# EAGLE design CouchProtato-TOP (EAGLE 9.5.2)
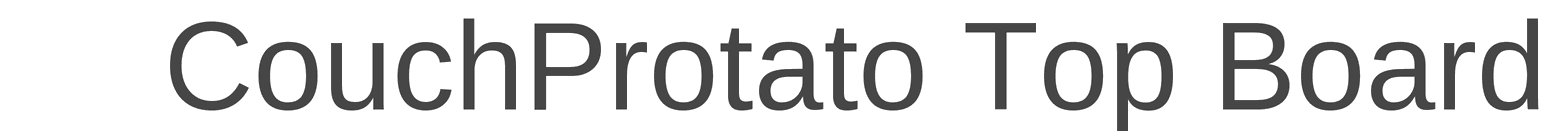
[diagram p0: schematic, sheet 1, part 1 of 2]
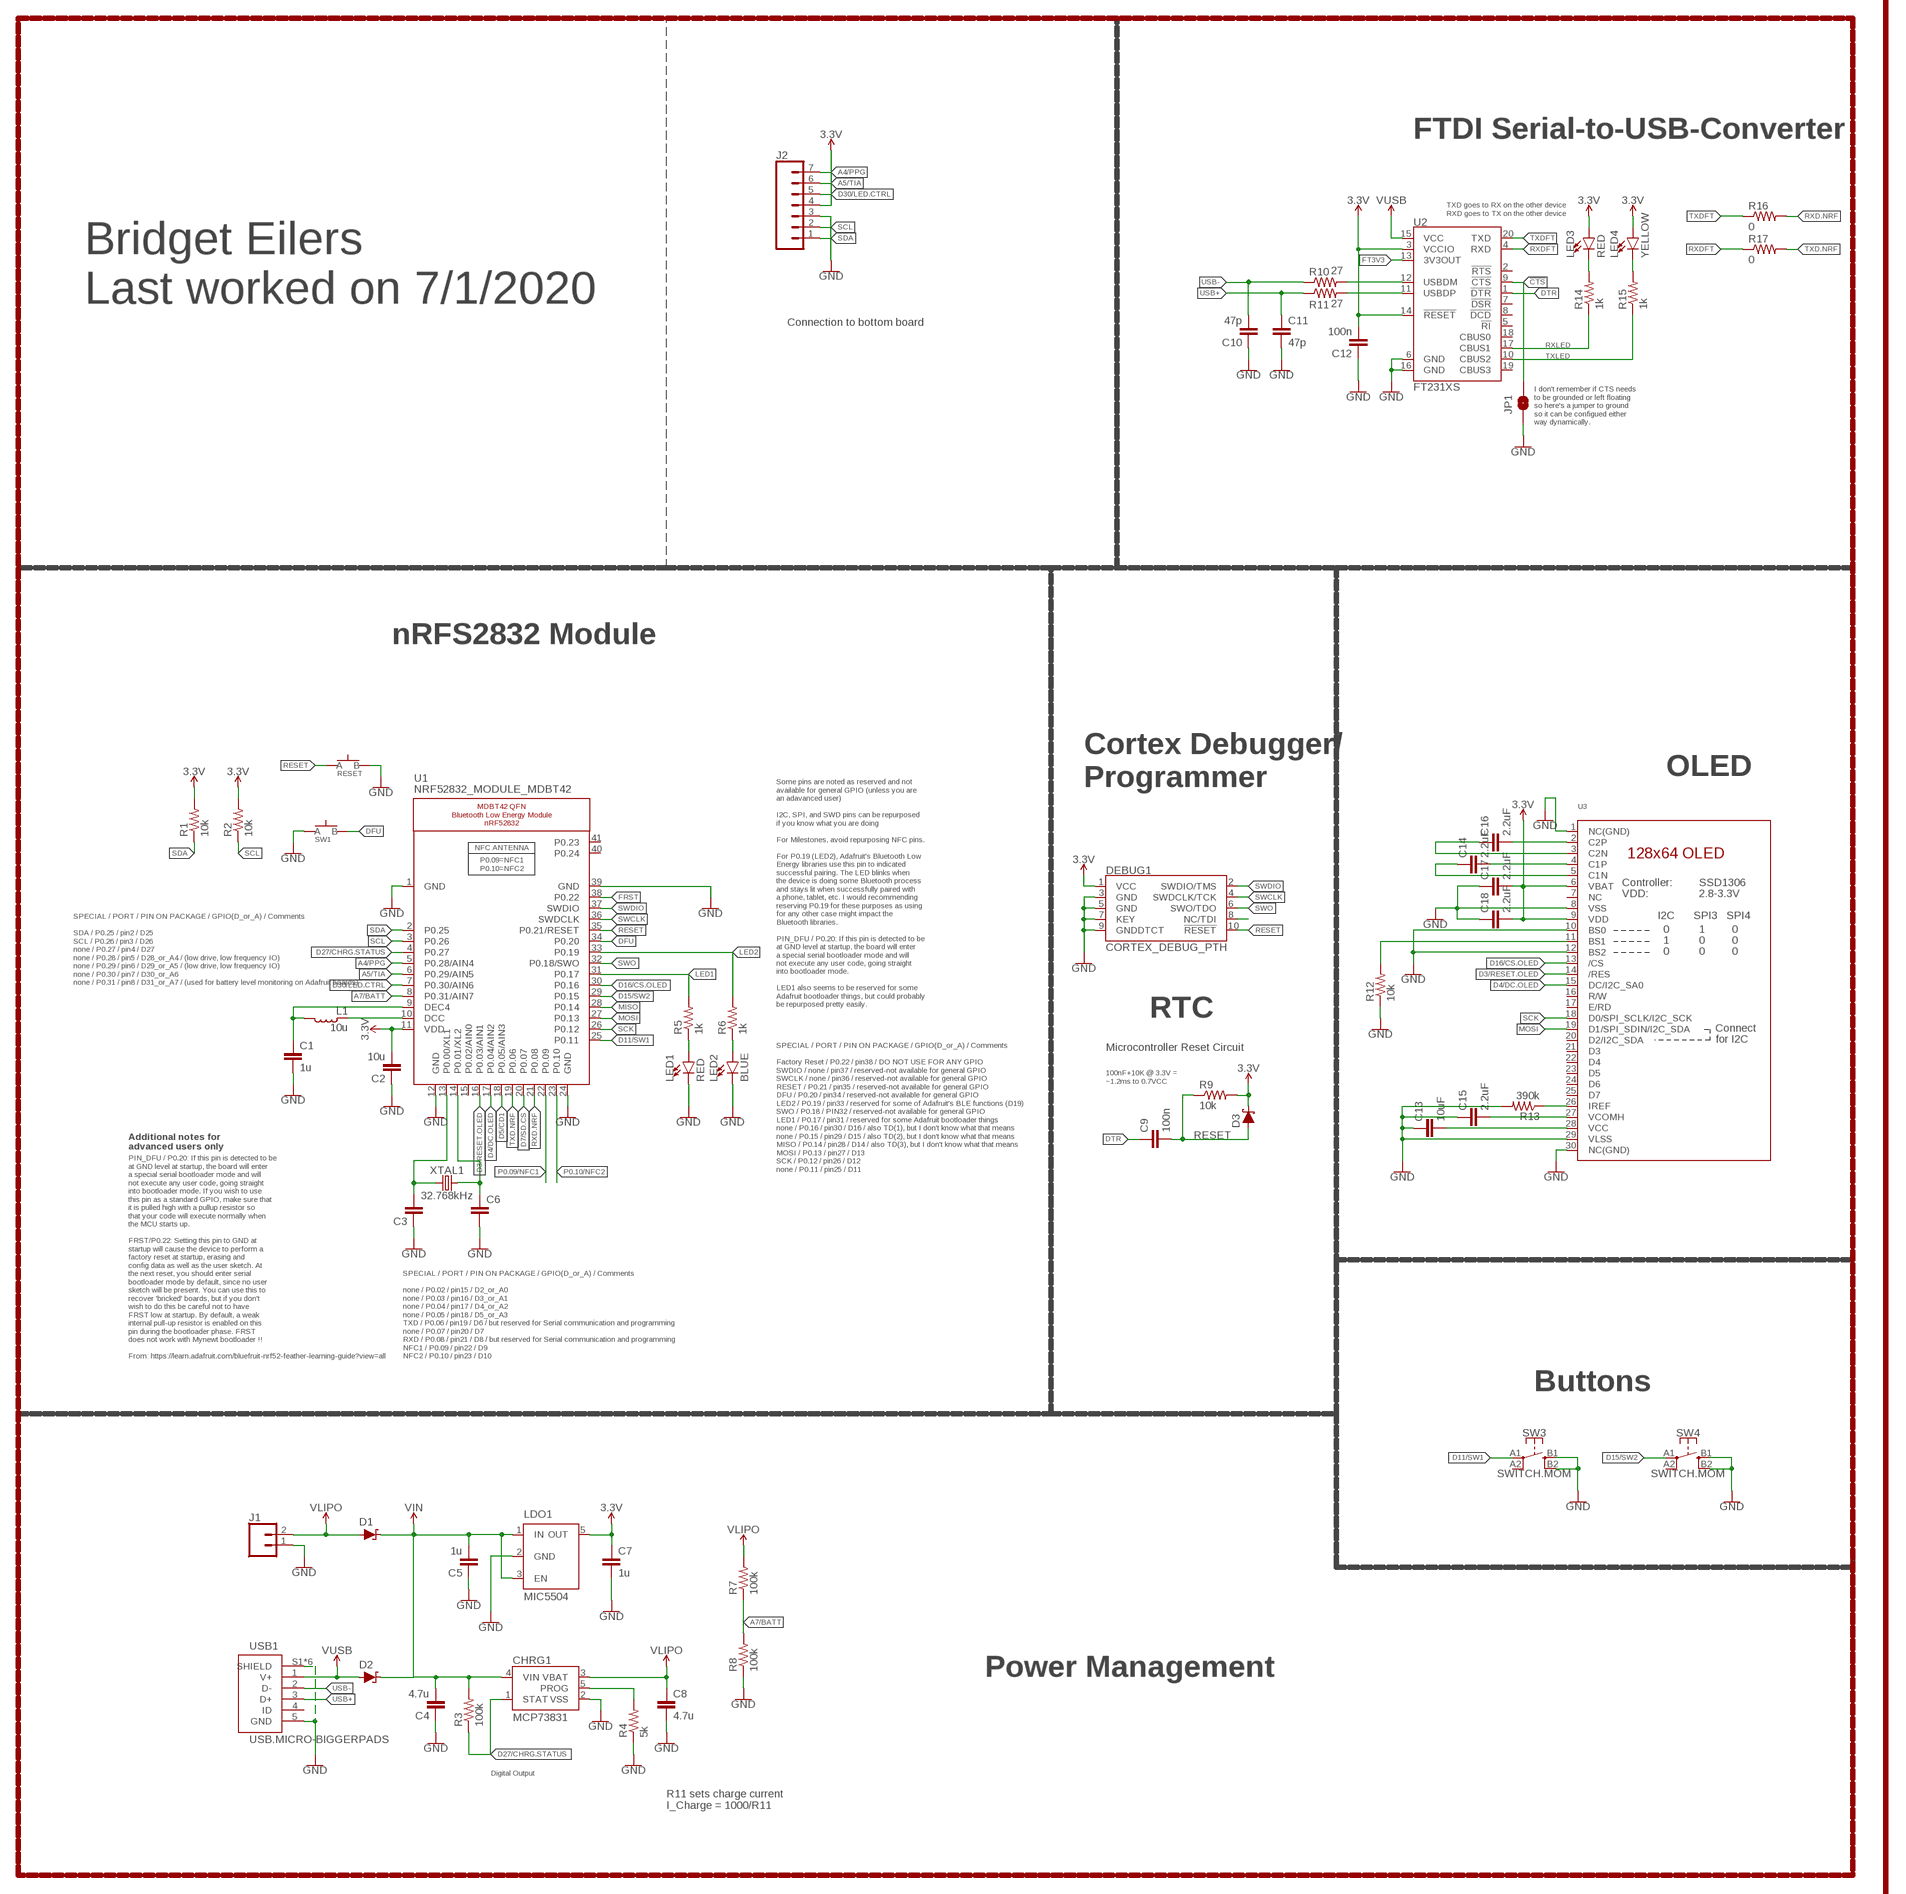
[diagram p1: schematic, sheet 1, part 2 of 2]

## Parts
C1  1u  CAPACITOR0603  [C0603]
C2  10u  CAPACITOR0805  [C0805]
C3  CAPACITOR0603  [C0603]
C4  4.7u  CAPACITOR0603  [C0603]
C5  1u  CAPACITOR0603  [C0603]
C6  CAPACITOR0603  [C0603]
C7  1u  CAPACITOR0603  [C0603]
C8  4.7u  CAPACITOR0603  [C0603]
C9  100n  CAPACITOR0603  [C0603]
C10  47p  CAPACITOR0603  [C0603]
C11  47p  CAPACITOR0603  [C0603]
C12  100n  CAPACITOR0603  [C0603]
C13  10uF  CAPACITOR0603  [C0603]
C14  2.2uF  CAPACITOR0402  [C0402]
C15  2.2uF  CAPACITOR0603  [C0603]
C16  2.2uF  CAPACITOR0402  [C0402]
C17  2.2uF  CAPACITOR0402  [C0402]
C18  2.2uF  CAPACITOR0402  [C0402]
CHRG1  MCP73831  [SOT23-5]
D1  SCHOTTKY-USC  [USC]
D2  SCHOTTKY-USC  [USC]
D3  SCHOTTKY-USC  [USC]
DEBUG1  CORTEX_DEBUG_PTH  [2X5-PTH-1.27MM]
J1  CONN_02  [1X02]
J2  CONN_07-1.27MM  [1X07_1.27MM]
JP1  JUMPER-SMT_2_NO_SILK  [SMT-JUMPER_2_NO_SILK]
L1  10u  INDUCTOR0603  [L0603]
LDO1  MIC5504  [SOT23-5]
LED1  RED  LED0603  [LED-0603]
LED2  BLUE  LED0603  [LED-0603]
LED3  RED  LED0603  [LED-0603]
LED4  YELLOW  LED0603  [LED-0603]
R1  10k  RESISTOR0603  [R0603]
R2  10k  RESISTOR0603  [R0603]
R3  100k  RESISTOR0603  [R0603]
R4  5k  RESISTOR0603  [R0603]
R5  1k  RESISTOR0603  [R0603]
R6  1k  RESISTOR0603  [R0603]
R7  100k  RESISTOR0603  [R0603]
R8  100k  RESISTOR0603  [R0603]
R9  10k  RESISTOR0603  [R0603]
R10  27  RESISTOR0603  [R0603]
R11  27  RESISTOR0603  [R0603]
R12  10k  RESISTOR0603  [R0603]
R13  390k  RESISTOR0603  [R0603]
R14  1k  RESISTOR0603  [R0603]
R15  1k  RESISTOR0603  [R0603]
R16  0  RESISTOR0603  [R0603]
R17  0  RESISTOR0603  [R0603]
RESET  SPST-PTS830GG140-COPY.1-3  [BUTTON-GULLWING]
SW1  SPST-PTS830GG140-COPY.1-3  [BUTTON-GULLWING]
SW3  SWITCH.MOM  [TACTILE_SWITCH_SMD_6.2MM_TALL]
SW4  SWITCH.MOM  [TACTILE_SWITCH_SMD_6.2MM_TALL]
U1  NRF52832_MODULE_MDBT42  [BLE_MODULE_RAYTAC_MDBT42]
U2  FT231XS  [SSOP20_L]
U3  DISP_OLED_UG-2864HSWEG01-NO-WRAPAROUND  [UG-2864HSWEG01_0.96IN_NO-WRAPAROUND]
USB1  USB.MICRO-BIGGERPADS  [USB-MICRO-01.BIGGERPADS]
XTAL1  32.768kHz  CRYSTALECS-.327-12.5-12-C-TR  [2-SMD.NOLEAD.2.0MMTO1.2MM]

## Nets
3.3V: C2.2 C7.1 C12.2 C17.2 C18.2 D3.-(C) DEBUG1.1(VCC) J2.4 LDO1.5(OUT) LED3.A LED4.A R1.2 R2.2 R9.2 U1.11(VDD) U2.3(VCCIO) U2.14(!RESET) U3.6(VBAT) U3.9(VDD)
!CTS: JP1.2 U2.9(!CTS)
A4/PPG: J2.7 U1.5(P0.28/AIN4)
A5/TIA: J2.6 U1.6(P0.29/AIN5)
A7/BATT: R7.1 R8.2 U1.8(P0.31/AIN7)
D3/RESET.OLED: U1.16(P0.03/AIN1) U3.14(/RES)
D4/DC.OLED: U1.17(P0.04/AIN2) U3.15(DC/I2C_SA0)
D5/CD1: U1.18(P0.05/AIN3)
D7/SD.CS: U1.20(P0.07)
D11/SW1: SW3.A1 U1.25(P0.11)
D15/SW2: SW4.A1 U1.29(P0.15)
D16/CS.OLED: U1.30(P0.16) U3.13(/CS)
D27/CHRG.STATUS: CHRG1.1(STAT) R3.1 U1.4(P0.27)
D30/LED.CTRL: J2.5 U1.7(P0.30/AIN6)
DFU: SW1.3(B) U1.34(P0.20)
DTR: C9.1 U2.1(!DTR)
FRST: U1.38(P0.22)
FT3V3: U2.13(3V3OUT)
GND: C1.2 C2.1 C3.1 C4.1 C5.1 C6.2 C7.2 C8.2 C10.1 C11.2 C12.1 C13.1 C15.1 C17.1 C18.1 CHRG1.2(VSS) DEBUG1.3(GND) DEBUG1.5(GND) DEBUG1.7(KEY) DEBUG1.9(GNDDTCT) J1.1 J2.3 JP1.1 LDO1.2(GND) LED1.C LED2.C R4.1 R8.1 R12.1 R13.2 RESET.3(B) SW1.1(A) SW3.B1 SW3.B2 SW4.B1 SW4.B2 U1.1(GND) U1.12(GND) U1.24(GND) U1.39(GND) U2.6(GND) U2.16(GND) U3.1(NC(GND)) U3.8(VSS) U3.10(BS0) U3.12(BS2) U3.29(VLSS) U3.30(NC(GND)) USB1.5(GND) USB1.S1(SHIELD) USB1.S2(SHIELD) USB1.S3(SHIELD) USB1.S4(SHIELD) USB1.S5(SHIELD) USB1.S6(SHIELD)
LED1: R5.2 U1.31(P0.17)
LED2: R6.2 U1.33(P0.19)
MISO: U1.28(P0.14)
MOSI: U1.27(P0.13) U3.19(D1/SPI_SDIN/I2C_SDA)
N$1: R12.2 U3.11(BS1)
N$2: R13.1 U3.26(IREF)
N$3: C16.2 U3.2(C2P)
N$4: C3.2 U1.13(P0.00/XL1) XTAL1.P$1
N$5: C16.1 U3.3(C2N)
N$6: C6.1 U1.14(P0.01/XL2) XTAL1.P$2
N$7: C14.2 U3.4(C1P)
N$8: C14.1 U3.5(C1N)
N$9: LED1.A R5.1
N$10: LED2.A R6.1
N$11: L1.1 U1.10(DCC)
N$12: C1.1 L1.2 U1.9(DEC4)
N$13: C13.2 U3.28(VCC)
N$14: DEBUG1.8(NC/TDI)
N$15: C15.2 U3.27(VCOMH)
N$16: CHRG1.5(PROG) R4.2
N$23: R10.2 U2.12(USBDM)
N$24: R11.2 U2.11(USBDP)
N$25: LED3.C R14.2
N$26: LED4.C R15.2
P0.09/NFC1: U1.22(P0.09)
P0.10/NFC2: U1.23(P0.10)
RESET: C9.2 D3.+(A) DEBUG1.10(!RESET) R9.1 RESET.1(A) U1.35(P0.21/RESET)
RXD.NRF: R16.2 U1.21(P0.08)
RXDFT: R17.1 U2.4(RXD)
RXLED: R14.1 U2.17(CBUS1)
SCK: U1.26(P0.12) U3.18(D0/SPI_SCLK/I2C_SCK)
SCL: J2.2 R2.1 U1.3(P0.26)
SDA: J2.1 R1.1 U1.2(P0.25)
SWCLK: DEBUG1.4(SWDCLK/TCK) U1.36(SWDCLK)
SWDIO: DEBUG1.2(SWDIO/TMS) U1.37(SWDIO)
SWO: DEBUG1.6(SWO/TDO) U1.32(P0.18/SWO)
TXD.NRF: R17.2 U1.19(P0.06)
TXDFT: R16.1 U2.20(TXD)
TXLED: R15.1 U2.10(CBUS2)
USB+: C11.1 R11.1 USB1.3(D+)
USB-: C10.2 R10.1 USB1.2(D-)
V_USB: D2.+(A) U2.15(VCC) USB1.1(V+) ; supply symbol labelled VUSB
VIN: C4.2 C5.2 CHRG1.4(VIN) D1.-(C) D2.-(C) LDO1.1(IN) LDO1.3(EN) R3.2
VLIPO: C8.1 CHRG1.3(VBAT) D1.+(A) J1.2 R7.2
Unconnected: SW3.A2 SW4.A2 U1.15(P0.02/AIN0) U1.40(P0.24) U1.41(P0.23) U2.2(!RTS) U2.5(!RI) U2.7(!DSR) U2.8(!DCD) U2.18(CBUS0) U2.19(CBUS3) U3.7(NC) U3.16(R/W) U3.17(E/RD) U3.20(D2/I2C_SDA) U3.21(D3) U3.22(D4) U3.23(D5) U3.24(D6) U3.25(D7) USB1.4(ID)

## Notes on the sheet
- CouchProtato Top Board
- FTDI Serial-to-USB-Converter
- TXD goes to RX on the other device
  RXD goes to TX on the other device
- Bridget Eilers
  Last worked on 7/1/2020
- Connection to bottom board
- I don't remember if CTS needs
  to be grounded or left floating
  so here's a jumper to ground
  so it can be configued either
  way dynamically.
- nRFS2832 Module
- OLED
- Cortex Debugger/
  Programmer
- SPECIAL / PORT / PIN ON PACKAGE / GPIO(D_or_A) / Comments
  
  SDA / P0.25 / pin2 / D25
  SCL / P0.26 / pin3 / D26
  none / P0.27 / pin4 / D27
  none / P0.28 / pin5 / D28_or_A4 / (low drive, low frequency IO)
  none / P0.29 / pin6 / D29_or_A5 / (low drive, low frequency IO)
  none / P0.30 / pin7 / D30_or_A6
  none / P0.31 / pin8 / D31_or_A7 / (used for battery level monitoring on Adafruit boards)
- Some pins are noted as reserved and not
  available for general GPIO (unless you are
  an adavanced user)
  
  I2C, SPI, and SWD pins can be repurposed
  if you know what you are doing
  
  For Milestones, avoid repurposing NFC pins.
  
  For P0.19 (LED2), Adafruit's Bluetooth Low
  Energy libraries use this pin to indicated
  successful pairing. The LED blinks when
  the device is doing some Bluetooth process
  and stays lit when successfully paired with
  a phone, tablet, etc. I would recommending
  reserving P0.19 for these purposes as using
  for any other case might impact the
  Bluetooth libraries.
  
  PIN_DFU / P0.20: If this pin is detected to be
  at GND level at startup, the board will enter
  a special serial bootloader mode and will
  not execute any user code, going straight
  into bootloader mode.
  
  LED1 also seems to be reserved for some
  Adafruit bootloader things, but could probably
  be repurposed pretty easily.
- RTC
- Microcontroller Reset Circuit
- 100nF+10K @ 3.3V =
  ~1.2ms to 0.7VCC
- Additional notes for
  advanced users only
- SPECIAL / PORT / PIN ON PACKAGE / GPIO(D_or_A) / Comments
  
  Factory Reset / P0.22 / pin38 / DO NOT USE FOR ANY GPIO
  SWDIO / none / pin37 / reserved-not available for general GPIO
  SWCLK / none / pin36 / reserved-not available for general GPIO
  RESET / P0.21 / pin35 / reserved-not available for general GPIO
  DFU / P0.20 / pin34 / reserved-not available for general GPIO
  LED2 / P0.19 / pin33 / reserved for some of Adafruit's BLE functions (D19)
  SWO / P0.18 / PIN32 / reserved-not available for general GPIO
  LED1 / P0.17 / pin31 / reserved for some Adafruit bootloader things
  none / P0.16 / pin30 / D16 / also TD(1), but I don't know what that means
  none / P0.15 / pin29 / D15 / also TD(2), but I don't know what that means
  MISO / P0.14 / pin28 / D14 / also TD(3), but I don't know what that means
  MOSI / P0.13 / pin27 / D13
  SCK / P0.12 / pin26 / D12
  none / P0.11 / pin25 / D11
- PIN_DFU / P0.20: If this pin is detected to be
  at GND level at startup, the board will enter
  a special serial bootloader mode and will
  not execute any user code, going straight
  into bootloader mode. If you wish to use
  this pin as a standard GPIO, make sure that
  it is pulled high with a pullup resistor so
  that your code will execute normally when
  the MCU starts up.
  
  FRST/P0.22: Setting this pin to GND at
  startup will cause the device to perform a
  factory reset at startup, erasing and
  config data as well as the user sketch. At
  the next reset, you should enter serial
  bootloader mode by default, since no user
  sketch will be present. You can use this to
  recover 'bricked' boards, but if you don't
  wish to do this be careful not to have
  FRST low at startup. By default, a weak
  internal pull-up resistor is enabled on this
  pin during the bootloader phase. FRST
  does not work with Mynewt bootloader !!
  
  From: https://learn.adafruit.com/bluefruit-nrf52-feather-learning-guide?view=all
- SPECIAL / PORT / PIN ON PACKAGE / GPIO(D_or_A) / Comments
  
  none / P0.02 / pin15 / D2_or_A0
  none / P0.03 / pin16 / D3_or_A1
  none / P0.04 / pin17 / D4_or_A2
  none / P0.05 / pin18 / D5_or_A3
  TXD / P0.06 / pin19 / D6 / but reserved for Serial communication and programming
  none / P0.07 / pin20 / D7
  RXD / P0.08 / pin21 / D8 / but reserved for Serial communication and programming
  NFC1 / P0.09 / pin22 / D9
  NFC2 / P0.10 / pin23 / D10
- Buttons
- Power Management
- Digital Output
- R11 sets charge current 
  I_Charge = 1000/R11

## Library data of the parts
C1-C18 = LinnesLab-Passives:CAPACITOR
CHRG1 = LinnesLab-Power:MCP73831: MCP73831T Li-Ion, Li-Pol Controller Miniature single cell, fully integrated Li-Ion, Li-polymer charge management controller Datasheet <http://ww1.microchip.com/downloads/en/DeviceDoc/20001984g.pdf> SparkFun Products: SparkFun ESP32 Thing <https://www.sparkfun.com/products/13907> SparkFun 9DoF Razor IMU M0 <https://www.sparkfun.com/products/14001>; PROD_ID: IC-09995
D1-D3 = LinnesLab-DiscreteSemi:SCHOTTKY: Schottky diode A Schottky diode is a semiconductor diode which has a low forward voltage drop and a very fast switching action. Example: Digi-Key Part Number: RB161MM-20CT-ND
DEBUG1 = LinnesLab-Connectors:CORTEX_DEBUG: Cortex Debug Connector - 10 pin Supports JTAG debug, Serial Wire debug, and Serial Wire Viewer. PTH and SMD connector options available. General Connector Information <http://infocenter.arm.com/help/topic/com.arm.doc.faqs/attached/13634/cortex_debug_connectors.pdf> Products: PTH Connector <http://www.digikey.com/product-detail/en/cnc-tech/3220-10-0100-00/1175-1627-ND/3883661> -via Digi-Key SparkFun PSoc <https://www.sparkfun.com/products/13229> SparkFun T <https://www.sparkfun.com/products/13810>
J1 = LinnesLab-Connectors:CONN_02: Multi connection point. Often used as Generic Header-pin footprint for 0.1 inch spaced/style header connections On any of the 0.1 inch spaced packages, you can populate with these: Break Away Headers - Straight <https://www.sparkfun.com/products/116> (PRT-00116) Break Away Male Headers - Right Angle <https://www.sparkfun.com/products/553> (PRT-00553) Female Headers <https://www.sparkfun.com/products/115> (PRT-00115) Break Away Headers - Machine Pin <https://www.sparkfun.com/products/117> (PRT-00117) Break Away Female Headers - Swiss Machine Pin <https://www.sparkfun.com/products/743> (PRT-00743) For SCREWTERMINALS and SPRING TERMINALS visit here: Screw Terimnals on SparkFun.com <https://www.sparkfun.com/search/results?term=Screw+Terminals> (5mm/3.5mm/2.54mm spacing) This device is also useful as a general connection point to wire up your design to another part of your project. Our various solder wires solder well into these plated through hole pads. Hook-Up Wire - Assortment (Stranded, 22 AWG) <https://www.sparkfun.com/products/11375> (PRT-11375) Hook-Up Wire - Assortment (Solid Core, 22 AWG) <https://www.sparkfun.com/products/11367> (PRT-11367) View the entire wire category on our website here <https://www.sparkfun.com/categories/141> Special notes: Molex polarized connector foot print use with: PRT-08233 with associated crimp pins and housings. 2.54_SCREWTERM for use with PRT-10571. 3.5mm Screw Terminal footprints for PRT-08084 5mm Screw Terminal footprints for use with PRT-08432
J2 = LinnesLab-Connectors:CONN_07: Multi connection point. Often used as Generic Header-pin footprint for 0.1 inch spaced/style header connections On any of the 0.1 inch spaced packages, you can populate with these: Break Away Headers - Straight <https://www.sparkfun.com/products/116> (PRT-00116) Break Away Male Headers - Right Angle <https://www.sparkfun.com/products/553> (PRT-00553) Female Headers <https://www.sparkfun.com/products/115> (PRT-00115) Break Away Headers - Machine Pin <https://www.sparkfun.com/products/117> (PRT-00117) Break Away Female Headers - Swiss Machine Pin <https://www.sparkfun.com/products/743> (PRT-00743) For SCREWTERMINALS and SPRING TERMINALS visit here: Screw Terimnals on SparkFun.com <https://www.sparkfun.com/search/results?term=Screw+Terminals> (5mm/3.5mm/2.54mm spacing) This device is also useful as a general connection point to wire up your design to another part of your project. Our various solder wires solder well into these plated through hole pads. Hook-Up Wire - Assortment (Stranded, 22 AWG) <https://www.sparkfun.com/products/11375> (PRT-11375) Hook-Up Wire - Assortment (Solid Core, 22 AWG) <https://www.sparkfun.com/products/11367> (PRT-11367) View the entire wire category on our website here <https://www.sparkfun.com/categories/141> Special notes: Molex polarized connector foot print use with SKU : PRT-08231 with associated crimp pins and housings. 1MM SMD Version SKU: PRT-10208 NOTES ON THE VARIANTS LOCK and LOCK_LONGPADS... This footprint was designed to help hold the alignment of a through-hole component (i.e. 6-pin header) while soldering it into place. You may notice that each hole has been shifted either up or down by 0.005 of an inch from it's more standard position (which is a perfectly straight line). This slight alteration caused the pins (the squares in the middle) to touch the edges of the holes. Because they are alternating, it causes a "brace" to hold the component in place. 0.005 has proven to be the perfect amount of "off-center" position when using our standard breakaway headers. Although looks a little odd when you look at the bare footprint, once you have a header in there, the alteration is very hard to notice. Also,if you push a header all the way into place, it is covered up entirely on the bottom side.
JP1 = LinnesLab-Switches:JUMPER-SMT_2_NO: Normally open jumper This jumper has two pads in close proximity to each other. Apply solder to close the connection. Round pads are easier to solder for beginners, but are a lot larger. SparkFun Product that uses the round pads: SparkFun EL Sequencer <https://www.sparkfun.com/products/12781>
L1 = LinnesLab-Passives:INDUCTOR
LDO1 = LinnesLab-Power:MIC5504: MIC5504 Voltage Regulator Output Voltages: 1.0V to 3.3V Input Voltages: 2.5V to 5.5V Link to Datasheet http://ww1.microchip.com/downloads/en/DeviceDoc/MIC550X.pdf
LED1-LED4 = LinnesLab-LED:LED: LED (Generic) Standard schematic elements and footprints for 5mm, 3mm, 1206, and 0603 sized LEDs. Generic LEDs with no color specified. LTST-C190KGKT: arrow indicates cathode
R1-R17 = LinnesLab-Passives:RESISTOR
RESET SW1 = LinnesLab-Switches:SPST-PTS830GG140-COPY
SW3 SW4 = LinnesLab-Switches:SWITCH.MOM: PTS645SM43SMTR92 LFS
U1 = LinnesLab-Microcontrollers:NRF52832_MODULE_MDBT42: MDBT42 - BLE Module (nRF52832 QFN) VDD: 1.7-3.6V
U2 = LinnesLab-DigitalIC:FT231X: FTDI FT231X Full Speed USB to Full-handshake UART This USB2.0 Full Speed IC offers a compact bridge to full handshake UART interfaces. The device is a UART, capable of operating up to 3MBaud, with low power consumption (8mA). The FT231X includes the complete FT-X series feature set and enables USB to be added into a system design quickly and easily over a UART interface. Datasheet <http://cdn.sparkfun.com/datasheets/Components/General%20IC/DS_FT231X.pdf>; DIGIKEY: 768-1156-5-ND; MFN: FT231XS-U
U3 = LinnesLab-Displays:DISP_OLED_UG-2864HSWEG01: UG-2864HSWEG01 OLED display Both 1.3" and 0.96" models share the same FPC tab footprint, only the screen dimensions vary.
USB1 = LinnesLab-Connectors:USB.MICRO: DigiKey PN: 609-4613-1-ND
XTAL1 = LinnesLab-Clocks:CRYSTAL; DIGIKEY: XC2288CT-ND; FREQ: 32.7680KHZ; LOAD_CAP: 12.5pF

## Board
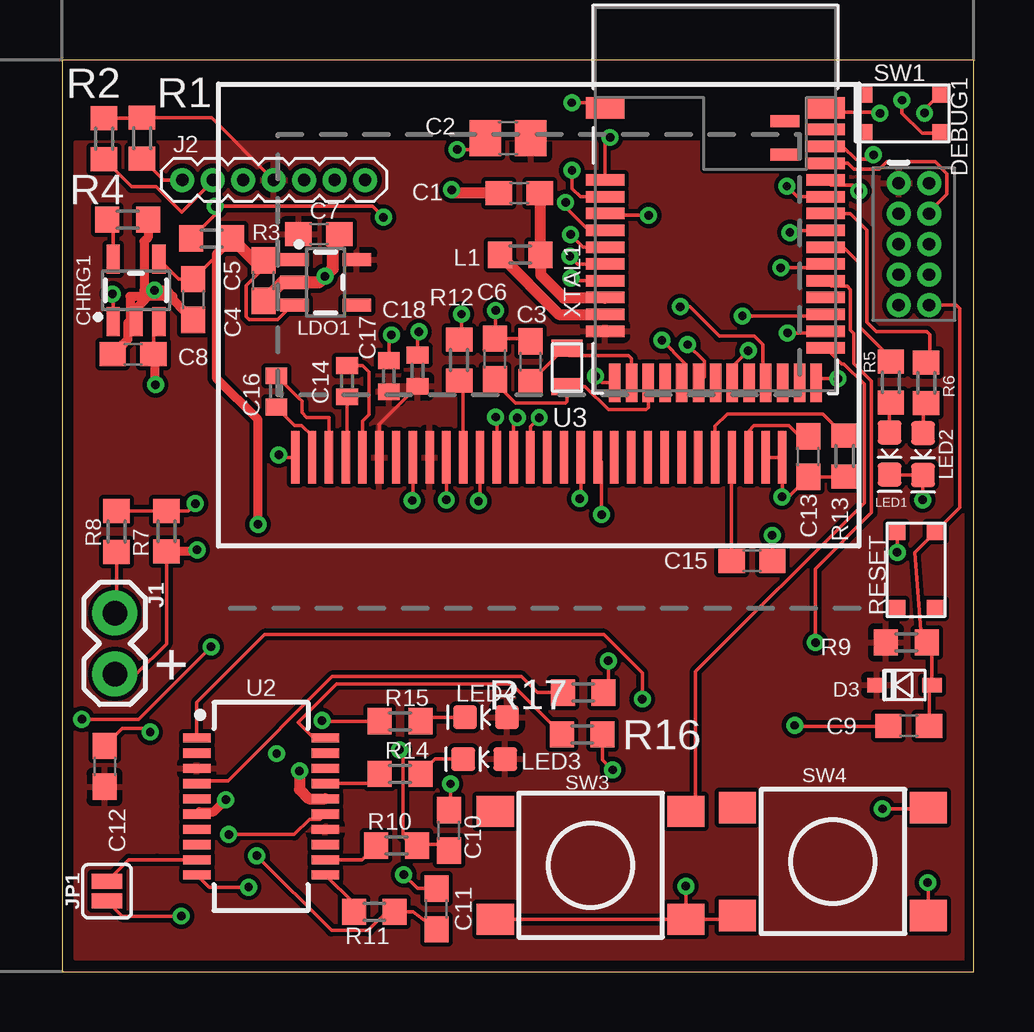
[diagram p2: board, top side]
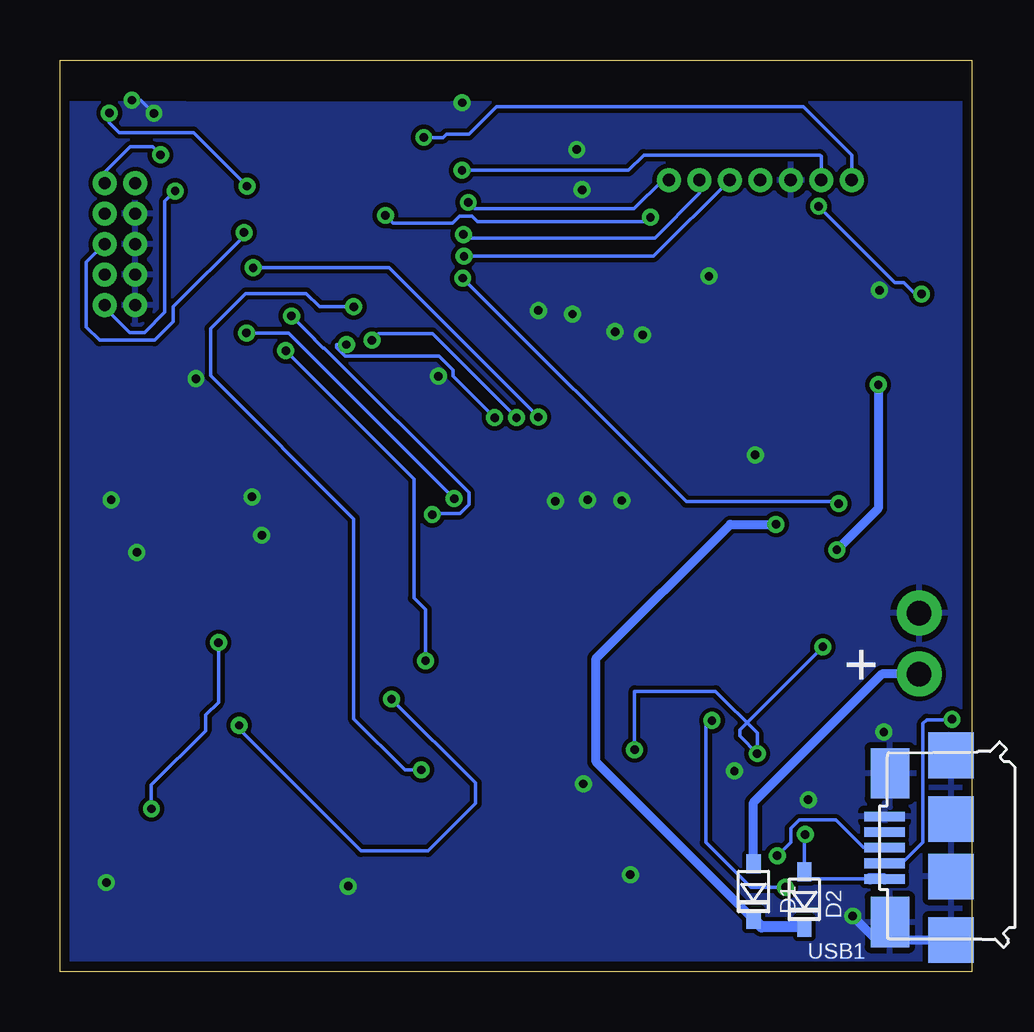
[diagram p3: board, bottom side, seen from below]

Size 38 x 38 mm. Coordinates in mm from the lower left corner, seen from the top.
Outline: 0,0 38,0 38,38 0,38 0,0
Copper layers (1*16): Top 0.0356mm / dielectric 1.5011mm / Bottom 0.0356mm
Design rules "LaenPCBOrder": minimum track width 6mil, minimum drill 13mil, track to track 6mil, track to pad 6mil, pad to pad 6mil, via to via 6mil, smd to smd 6mil, copper to edge 15mil, drill to drill 6mil, minimum pad ring 7mil, minimum via ring 7mil, stop-mask expansion 3mil, vias tented up to drill 0mil, thermal gap 10mil

### Footprints (pad centres in the part's own frame; a part is rotated, then mirrored left to right if it is on the bottom)
C0603 = smd 1.1 x 1: 1 -0.85,0; 2 0.85,0
C0805 = smd 1.3 x 1.5: 1 -0.95,0; 2 0.95,0
C0402 = smd 0.7 x 0.9: 1 -0.65,0; 2 0.65,0
SOT23-5 = smd 0.55 x 1.2: 1 -0.95,-1.3; 2 0,-1.3; 3 0.95,-1.3; 4 0.95,1.3; 5 -0.95,1.3
USC = smd 0.8 x 0.6: + -1.15,0; - 1.15,0
2X5-PTH-1.27MM = drill 0.508 pad 1: 1 -2.54,-0.635; 2 -2.54,0.635; 3 -1.27,-0.635; 4 -1.27,0.635; 5 0,-0.635; 6 0,0.635; 7 1.27,-0.635; 8 1.27,0.635; 9 2.54,-0.635; 10 2.54,0.635
1X02 = drill 1.016 pad 1.88: 1 0,0; 2 2.54,0
1X07_1.27MM = drill 0.508 pad 1: 1 0,0; 2 1.27,0; 3 2.54,0; 4 3.81,0; 5 5.08,0; 6 6.35,0; 7 7.62,0
SMT-JUMPER_2_NO_SILK = smd 0.635 x 1.27: 1 -0.406,0; 2 0.406,0
L0603 = smd 1 x 1.1: 1 -0.85,0; 2 0.85,0
LED-0603 = smd 1 x 1: A -0.877,0; C 0.877,0
R0603 = smd 1 x 1.1: 1 -0.85,0; 2 0.85,0
BUTTON-GULLWING = smd 0.7 x 0.75: 1 -1.6,0.825; 2 1.6,0.825; 3 -1.6,-0.825; 4 1.6,-0.825
TACTILE_SWITCH_SMD_6.2MM_TALL = smd 1.55 x 1.3: A1 -3.975,-2.25; A2 3.975,-2.25; B1 -3.975,2.25; B2 3.975,2.25
BLE_MODULE_RAYTAC_MDBT42 = smd 1.6 x 0.9: 1 -4.6,3.8; 39 4.6,3.8 | smd 1.6 x 0.48: 2 -4.6,0.8; 3 -4.6,0.1; 4 -4.6,-0.6; 5 -4.6,-1.3; 6 -4.6,-2; 7 -4.6,-2.7; 8 -4.6,-3.4; 9 -4.6,-4.1; 10 -4.6,-4.8; 11 -4.6,-5.5; 25 4.6,-6.2; 26 4.6,-5.5; 27 4.6,-4.8; 28 4.6,-4.1; 29 4.6,-3.4; 30 4.6,-2.7; 31 4.6,-2; 32 4.6,-1.3; 33 4.6,-0.6; 34 4.6,0.1; 35 4.6,0.8; 36 4.6,1.5; 37 4.6,2.2; 38 4.6,2.9 | smd 0.48 x 1.6: 12 -4.2,-7.65; 13 -3.5,-7.65; 14 -2.8,-7.65; 15 -2.1,-7.65; 16 -1.4,-7.65; 17 -0.7,-7.65; 18 0,-7.65; 19 0.7,-7.65; 20 1.4,-7.65; 21 2.1,-7.65; 22 2.8,-7.65; 23 3.5,-7.65; 24 4.2,-7.65 | smd 1.2 x 0.5: 40 2.9,3.25; 41 2.9,1.85
SSOP20_L = smd 0.381 x 1.143: 1 -2.857,-2.68; 2 -2.223,-2.68; 3 -1.587,-2.68; 4 -0.953,-2.68; 5 -0.318,-2.68; 6 0.318,-2.68; 7 0.953,-2.68; 8 1.587,-2.68; 9 2.223,-2.68; 10 2.857,-2.68; 11 2.857,2.68; 12 2.223,2.68; 13 1.587,2.68; 14 0.953,2.68; 15 0.318,2.68; 16 -0.318,2.68; 17 -0.953,2.68; 18 -1.587,2.68; 19 -2.223,2.68; 20 -2.857,2.68
UG-2864HSWEG01_0.96IN_NO-WRAPAROUND = smd 0.35 x 2.2: 1 -10.15,-1.2; 2 -9.45,-1.2; 3 -8.75,-1.2; 4 -8.05,-1.2; 5 -7.35,-1.2; 6 -6.65,-1.2; 7 -5.95,-1.2; 8 -5.25,-1.2; 9 -4.55,-1.2; 10 -3.85,-1.2; 11 -3.15,-1.2; 12 -2.45,-1.2; 13 -1.75,-1.2; 14 -1.05,-1.2; 15 -0.35,-1.2; 16 0.35,-1.2; 17 1.05,-1.2; 18 1.75,-1.2; 19 2.45,-1.2; 20 3.15,-1.2; 21 3.85,-1.2; 22 4.55,-1.2; 23 5.25,-1.2; 24 5.95,-1.2; 25 6.65,-1.2; 26 7.35,-1.2; 27 8.05,-1.2; 28 8.75,-1.2; 29 9.45,-1.2; 30 10.15,-1.2
USB-MICRO-01.BIGGERPADS = smd 0.4 x 1.7: 1 -1.3,1.505; 2 -0.65,1.505; 3 0,1.505; 4 0.65,1.505; 5 1.3,1.505 | smd 1.9 x 1.9: S1 -3.85,-1.27; S2 -1.2,-1.27; S3 1.2,-1.27; S4 3.85,-1.27 | smd 2.1 x 1.6: S5 -3.1,1.28; S6 3.1,1.28
2-SMD.NOLEAD.2.0MMTO1.2MM = smd 0.7 x 1.3: P$1 -0.8,0; P$2 0.8,0

### Placement (x,y rotation side)
C1  19.04,32.45 180 top
C2  18.58,34.74 0 top
C3  19.51,25.42 270 top
C4  5.46,28.02 90 top
C5  8.38,28.8 90 top
C6  18.03,25.54 90 top
C7  10.69,30.73 0 top
C8  2.95,25.73 180 top
C9  35.28,10.24 0 top
C10  16.11,5.88 270 top
C11  15.59,2.61 90 top
C12  1.76,8.55 270 top
C13  31.09,21.47 90 top
C14  11.87,24.61 270 top
C15  28.75,17.12 180 top
C16  8.91,24.19 270 top
C17  13.61,24.82 270 top
C18  14.8,25.05 270 top
CHRG1  3.07,28.4 0 top
D1  9.08,3.34 270 bottom
D2  6.97,3.01 270 bottom
D3  35.1,11.94 180 top
DEBUG1  35.5,30.32 270 top
J1  2.18,14.94 270 top
J2  5,33 0 top
JP1  1.86,3.35 90 top
L1  19.08,29.88 0 top
LDO1  10.97,28.73 270 top
LED1  34.48,21.6 270 top
LED2  35.88,21.57 270 top
LED3  17.58,8.86 180 top
LED4  17.66,10.6 180 top
R1  3.32,34.74 90 top
R2  1.73,34.72 90 top
R3  6.22,30.56 0 top
R4  2.72,31.34 180 top
R5  34.53,24.57 90 top
R6  36.01,24.54 90 top
R7  4.34,18.36 270 top
R8  2.26,18.35 90 top
R9  35.18,13.72 180 top
R10  13.93,5.25 180 top
R11  13,2.49 180 top
R12  16.54,25.49 270 top
R13  32.61,21.49 270 top
R14  14.08,8.24 0 top
R15  14.08,10.43 0 top
R16  21.67,9.88 0 top
R17  21.71,11.63 0 top
RESET  35.58,16.74 270 top
SW1  35.01,35.77 180 top
SW3  22.02,4.43 180 top
SW4  32.12,4.59 180 top
U1  27.22,32.2 0 top
U2  8.28,6.88 270 top
U3  19.86,22.64 0 top
USB1  2.12,5.16 90 bottom
XTAL1  21.04,25.19 270 top

### Tracks (layer width: path | path; a pad name or v marks a point on that pad's centre or on a via)
3.3V
  Top 0.152: C18.2 13.21,22.8 U3.6 | R2.2 3.3,35.57 R1.2 6.22,35.59 J2.4
  pour Top (isolate 0.178): 0.53,34.57 37.72,34.57 37.72,0.53 0.53,0.53
!CTS
  Top 0.152: U2.9 3.94,4.66 2.76,4.66 JP1.2
A4/PPG  (via drill 0.35)
  Top 0.152: U1.5 21.95,30.9 20.98,31.86 v20.98,32.06
  Bottom 0.152: v20.98,32.06 20.73,31.81 14.06,31.81 12.87,33 J2.7
A5/TIA  (via drill 0.35)
  Top 0.152: U1.6 21.71,30.2 v21.18,30.72
  Bottom 0.152: v21.18,30.72 21.04,30.58 13.21,30.58 11.35,32.44 J2.6
A7/BATT  (via drill 0.35)
  Top 0.152: U1.8 21.32,28.8 v21.21,28.91 | v5.54,19.51 5.24,19.21 R7.1 R8.2
  Bottom 0.152: v21.21,28.91 11.89,19.58 5.61,19.58 v5.54,19.51
D3/RESET.OLED  (via drill 0.35)
  Top 0.152: U3.14 18.81,22.93 v18.97,23.09 | v24.99,26.31 25.96,25.35 25.96,24.68 U1.16
  Bottom 0.152: v24.99,26.31 24.71,26.59 22.47,26.59 v18.97,23.09
D4/DC.OLED  (via drill 0.35)
  Top 0.152: U3.15 19.51,22.72 v19.88,23.09 | v26.06,26.14 26.75,25.44 26.75,24.78 U1.17
  Bottom 0.152: v19.88,23.09 21.62,24.83 21.62,25.07 22.21,25.66 26.11,25.66 26.46,26.01 26.46,26.14 v26.06,26.14
D11/SW1
  Top 0.152: SW3.A1 26.4,7.09 26.4,12.5 33.43,19.53 33.43,24.48 32.59,25.32 32.5,25.32 U1.25
D15/SW2  (via drill 0.35)
  Top 0.152: U1.29 32.05,28.56 32.72,28.56 32.85,28.43 32.85,26.74 32.99,26.6 32.99,25.34 33.73,24.61 33.73,19.13 31.39,16.79 v31.39,13.72 | v34.19,6.78 36.04,6.78 SW4.A1
  Bottom 0.152: v34.19,6.78 34.19,7.77 31.93,10.03 31.93,10.69 31.39,11.23 v31.39,13.72
D16/CS.OLED  (via drill 0.35)
  Top 0.152: U3.13 18.11,23.06 v18.06,23.11 | v29.95,29.34 31.66,29.34 U1.30
  Bottom 0.152: v18.06,23.11 24.28,29.34 v29.95,29.34
D27/CHRG.STATUS  (via drill 0.35)
  Top 0.152: R3.1 6.38,31.56 v6.38,31.9 12.93,31.9 v13.39,31.45 | v2.08,28.25 2.12,28.2 CHRG1.1 | v24.43,31.52 22.7,31.52 U1.4
  Bottom 0.152: v6.38,31.9 3.2,28.73 2.83,28.73 2.35,28.25 v2.08,28.25 | v24.43,31.52 24.11,31.19 21.64,31.19 21.34,31.5 21.23,31.5 21.22,31.48 20.83,31.48 20.6,31.25 13.58,31.25 v13.39,31.45
D30/LED.CTRL  (via drill 0.35)
  Top 0.152: U1.7 21.48,29.5 21.46,29.51 | 21.46,29.51 | 21.46,29.51 v21.16,29.81
  Bottom 0.152: v21.16,29.81 13.27,29.81 J2.5
DFU  (via drill 0.35)
  Top 0.152: U1.34 30.64,32.3 v30.2,32.74 | v35.94,35.78 35.94,35.93 SW1.3
  Bottom 0.152: v30.2,32.74 32.44,34.98 35.53,34.98 35.94,35.38 v35.94,35.78
DTR  (via drill 0.35)
  Top 0.152: v24.18,11.35 24.18,12.45 22.57,14.05 8.43,14.05 5.6,11.21 U2.1 | v30.53,10.26 30.53,10.21 34.4,10.21 C9.1
  Bottom 0.152: v24.18,11.35 20.68,7.86 20.68,7.01 22.66,5.03 25.45,5.03 30.53,10.11 v30.53,10.26
GND  (via drill 0.35)
  Top 0.152: U3.1 9.12,21.44 v9.02,21.54 | C17.1 13.61,26.44 v13.72,26.54 | C18.1 14.8,26.61 v14.86,26.67 | U3.8 14.61,19.66 v14.58,19.63 | R12.1 16.59,26.34 16.73,26.48 16.64,26.57 v16.64,27.41 | U3.10 v16.01,19.67 v16,19.66 | U3.12 17.41,19.67 v17.35,19.61 | R8.1 2.26,15.02 J1.1 | C3.1 19.39,26.39 C6.2 | C6.2 17.57,25.93 | v18.06,27.56 18.06,26.42 C6.2 | U1.12 22.5,24.55 v22.23,24.82 | U3.29 U3.30 v30.01,19.8 v30,19.79 30.26,19.79 C13.1 32.59,20.62 R13.2 | RESET.3 34.8,18.3 v34.8,17.48 | LED1.C 34.51,20.69 LED2.C 35.87,20.68 v35.87,19.66 | U1.24 31.59,24.71 v32.33,24.71 | 32.11,35.71 U1.39 31.99,35.83 34.03,35.83 v34.08,35.77 | SW1.1 35.84,34.95 35,35.79 v35,36.32 | SW3.B1 25.99,3.55 v25.98,3.56 | SW4.B1 36.09,3.68 v36.07,3.71 | C12.1 2.49,10.13 3.5,10.13 v3.66,9.98 | C11.2 14.8,3.46 v14.22,4.04 | C10.1 16.18,6.81 v16.18,7.82 | JP1.1 2.49,2.31 v4.95,2.31 | U1.1 22.4,36.22 v21.23,36.22 | SW3.B2 SW3.B1 | C15.1 v29.6,18.19 v29.59,18.19 | SW4.B2 27.99,2.18 SW3.B1 | C2.1 17.15,34.27 v16.46,34.27
  Top 0.381: U2.6 5.7,6.67 6.32,6.67 v6.81,7.16 | v3.83,28.4 3.07,27.64 CHRG1.2 | C4.1 4.23,28.4 v3.83,28.4 | v3.83,28.4 4.34,28.4 4.6,28.14 2.82,28.14 2.82,27.13 2.74,27.05 2.74,26.36 2.54,26.15 2.52,26.15 C8.2 | R4.1 3.57,30.6 3.4,30.44 3.4,28.4 v3.83,28.4
  Top 0.457: C1.2 16.36,32.45 v16.23,32.59 | v9.88,8.36 9.88,7.59 10.27,7.2 U2.16
  Top 0.508: C7.2 11.54,30.4 11.27,30.12 11.27,29.3 v10.95,28.98 10.69,28.73 LDO1.2 9.16,28.73 C5.1
  Bottom 0.152: v35,36.32 34.63,36.32 v34.08,35.77
  Bottom 0.381: 4.27,6.46 USB1.5 | USB1.S1 3.95,1.31 v4.95,2.31
  pour Bottom (isolate 0.178): 0.33,36.22 37.85,36.22 37.85,0.48 0.33,0.48
LED1
  Top 0.152: R5.2 34.53,25.57 33.2,26.91 33.2,29.56 32.56,30.2 U1.31
LED2
  Top 0.152: U1.33 32.85,31.59 33.53,30.91 33.53,27.08 33.93,26.67 36.04,26.67 36.16,26.55 36.16,25.55 R6.2
MOSI  (via drill 0.35)
  Top 0.152: U3.19 22.48,21.27 v22.48,19.05 | v28.35,27.33 31.76,27.33 U1.27
  Bottom 0.152: v28.35,27.33 27.38,26.36 27.38,26.34 27.02,25.99 26.98,25.99 20.96,19.96 20.96,19.46 21.31,19.1 22.43,19.1 v22.48,19.05
N$1
  Top 0.152: R12.2 16.71,24.47 U3.11
N$2
  Top 0.152: R13.1 31.7,23.24 27.71,23.24 27.21,22.74 U3.26
N$3
  Top 0.152: C16.2 9.68,22.77 9.98,22.77 10.41,22.33 U3.2
N$4
  Top 0.152: U1.13 23.72,25.55 23.59,25.68 21.11,25.68 21.11,25.99 XTAL1.P$1 20.93,25.99 C3.2
N$5
  Top 0.152: C16.1 9.85,23.9 9.86,23.9 9.98,23.77 9.98,23.29 10.19,23.09 11.12,23.09 11.12,21.45 U3.3
N$6
  Top 0.152: U1.14 24.42,23.51 24.33,23.42 22.76,23.42 21.79,24.39 XTAL1.P$2 21.04,23.76 20.98,23.7 18.89,23.7 18.03,24.56 C6.1
N$7
  Top 0.152: C14.2 11.87,21.49 U3.4
N$8
  Top 0.152: C14.1 12.51,25.26 12.78,24.99 12.78,23.22 12.51,22.95 U3.5
N$9
  Top 0.152: LED1.A 34.48,23.67 R5.1
N$10
  Top 0.152: R6.1 35.88,23.57 LED2.A
N$11
  Top 0.457: L1.1 18.23,29.86 20.69,27.4 U1.10
N$12
  Top 0.457: U1.9 22.6,28.07 20.91,28.07 19.93,29.05 L1.2 19.93,32.41 C1.1
N$13
  Top 0.152: C13.2 30.73,22.32 30.28,22.77 29.04,22.77 29.03,22.76 28.83,22.76 28.61,22.54 U3.28
N$15
  Top 0.152: C15.2 27.9,21.43 U3.27
N$16
  Top 0.152: R4.2 2.12,31.09 CHRG1.5
N$23
  Top 0.152: R10.2 12.49,4.66 U2.12
N$24
  Top 0.152: R11.2 12.15,2.83 U2.11
N$25
  Top 0.152: LED3.C 15.54,8.86 R14.2
N$26
  Top 0.152: R15.2 15.1,10.6 LED4.C
RESET  (via drill 0.35)
  Top 0.152: C9.2 36.13,11.82 D3.+ 36.25,13.49 R9.1 35.8,13.95 35.54,17.48 RESET.1 37.41,19.35 37.41,27.64 37.27,27.78 DEBUG1.10 | U1.35 32.03,32.79 32.94,32.79 v33.2,32.54
  Bottom 0.152: DEBUG1.10 36.13,27.68 35.09,26.64 34.47,26.64 33.63,27.48 33.63,32.11 v33.2,32.54
RXD.NRF  (via drill 0.35)
  Top 0.152: v25.76,27.71 26.16,27.71 27.39,26.48 28.84,26.48 29.2,26.13 29.2,24.67 U1.21 | v22.94,8.41 22.52,8.83 R16.2
  Bottom 0.152: v25.76,27.71 27.18,27.71 27.74,28.27 30.25,28.27 31.73,26.8 31.73,24.84 25.76,18.87 25.76,10.54 23.62,8.41 v22.94,8.41
RXDFT
  Top 0.152: R17.1 19.81,11.63 19.14,12.29 11.25,12.29 6.9,7.95 5.72,7.95 U2.4
RXLED
  Top 0.152: R14.1 12.82,7.83 U2.17
SCK  (via drill 0.35)
  Top 0.152: U3.18 21.61,19.75 v21.57,19.71 | v30.23,26.62 31.75,26.62 U1.26
  Bottom 0.152: v21.57,19.71 28.47,26.62 v30.23,26.62
SCL  (via drill 0.35)
  Top 0.152: U1.3 21.59,32.3 21.24,32.64 v21.24,33.4 | R2.1 2.89,32.72 3.91,32.72 4.98,31.65 6.27,32.94 J2.2
  Bottom 0.152: v21.24,33.4 14.3,33.4 13.66,34.04 6.33,34.04 6.27,33.98 J2.2
SDA  (via drill 0.35)
  Top 0.152: v22.84,34.77 22.62,34.56 U1.2 | R1.1 4.21,33 J2.1
  Bottom 0.152: v22.84,34.77 22.02,34.77 21.89,34.9 20.96,34.9 19.81,36.04 7.01,36.04 5,34.03 J2.1
SWCLK
  Top 0.152: U1.36 32.74,33.7 32.99,33.44 34.06,33.44 34.37,33.75 36.38,33.75 36.87,33.27 36.87,32.4 36.13,31.67 DEBUG1.4
SWDIO  (via drill 0.35)
  Top 0.152: U1.37 32.54,34.4 33.07,33.87 33.63,33.87 v33.81,34.05
  Bottom 0.152: v33.81,34.05 34.14,34.38 35.07,34.38 36.13,33.32 DEBUG1.2
SWO  (via drill 0.35)
  Top 0.152: U1.32 30.41,30.9 v30.33,30.81
  Bottom 0.152: v30.33,30.81 30.33,30.66 33.27,27.71 33.27,27.1 34.06,26.31 36.35,26.31 36.91,26.87 36.91,29.57 36.16,30.32 DEBUG1.6
TXD.NRF  (via drill 0.35)
  Top 0.152: U1.19 27.92,25.21 v28.59,25.88 | v22.76,12.95 22.76,11.82 R17.2
  Bottom 0.152: v28.59,25.88 23.24,20.53 23.24,15.57 22.76,15.09 v22.76,12.95
TXDFT
  Top 0.152: R16.1 18.71,11.99 11.43,11.99 9.83,10.39 10.48,9.74 U2.20
TXLED  (via drill 0.35)
  Top 0.152: R15.1 10.93,10.43 10.9,10.46 v10.82,10.46 | v7.76,3.52 6.11,3.52 U2.10
  Bottom 0.152: v10.82,10.46 11,10.46 11.08,10.39 11.08,5.38 9.21,3.52 v7.76,3.52
USB+  (via drill 0.35)
  Top 0.152: C11.1 14.62,2.49 R11.1 13.53,2.49 12.75,1.71 11.22,1.71 v8.1,4.83
  Bottom 0.152: v8.1,4.83 7.54,5.39 7.54,5.97 7.19,6.32 5.66,6.32 4.52,5.18 3.64,5.18 USB1.3
USB-  (via drill 0.35)
  Top 0.152: C10.2 15.84,5.3 14.83,5.3 R10.1 14.58,5.25 14.2,5.63 14.2,9.09 v14.05,9.25 | v0.81,10.52 3.17,10.52 v6.2,13.54
  Bottom 0.152: v14.05,9.25 14.05,11.68 10.67,11.68 8.93,9.95 v8.93,9.08 9.67,9.82 9.67,10.07 v6.2,13.54 | v0.81,10.52 0.83,10.49 1.87,10.49 2.03,10.34 2.03,5.38 2.88,4.54 3.6,4.54 USB1.2
V_USB  (via drill 0.35)
  Top 0.152: U2.15 10.74,6.35 10.29,6.35 9.66,5.71 v6.93,5.71
  Bottom 0.152: 4.24,3.87 6.68,3.87 D2.+ 6.97,5.68 v6.93,5.71
  Bottom 0.457: 4.24,3.87 4.23,3.86 USB1.1
VIN  (via drill 0.35)
  Top 0.152: R3.2 7.07,30.48 C4.2 4.85,28.87 CHRG1.4 | LDO1.3 9.58,27.78 8.98,27.18 7.79,27.18 7.65,27.31 7.65,28.6 8.38,29.33 C5.2
  Top 0.381: v8.15,18.64 8.15,23.01 6.42,24.75 6.42,29.9 R3.2
  Top 0.508: R3.2 7.98,29.65 C5.2 8.41,29.68 LDO1.1
  Bottom 0.381: D1.- 15.65,8.75 15.65,13.06 10.06,18.64 v8.15,18.64
  Bottom 0.457: D2.- 8.75,1.85 D1.-
VLIPO  (via drill 0.35)
  Top 0.152: R7.2 4.34,13.67 3.08,12.4 J1.2 | C8.1 3.8,26.87 CHRG1.3
  Top 0.381: C8.1 3.85,25.68 3.85,24.46 v3.89,24.46 | v5.61,17.58 5.54,17.51 R7.2
  Bottom 0.381: D1.+ 9.08,7.05 3.73,12.4 J1.2 | v3.89,24.46 3.89,19.3 v5.61,17.58

### Text on the board
tNames: +
bNames: + | +